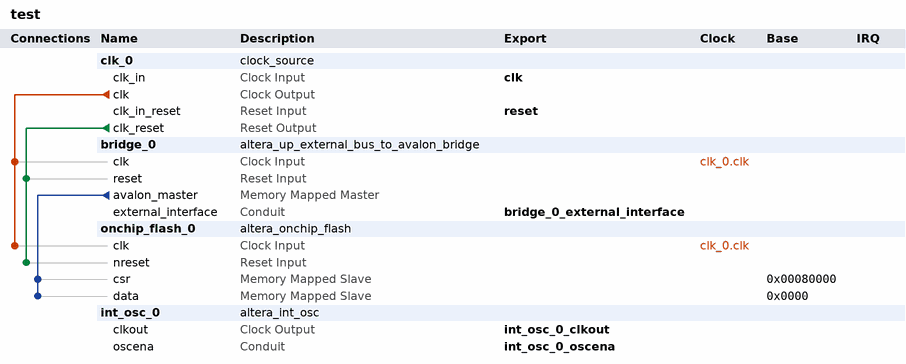
[diagram p0: system contents]
# Platform Designer (Qsys) system test, MAX 10 10M16SCU169C8G
# Parameters at their usual value, and those the tool derives, are not listed.
package require -exact qsys 22.1
create_system test
set_project_property DEVICE_FAMILY {MAX 10}
set_project_property DEVICE 10M16SCU169C8G

add_instance clk_0 clock_source 22.1
set_instance_parameter_value clk_0 clockFrequency 25000000

add_instance bridge_0 altera_up_external_bus_to_avalon_bridge 18.0
set_instance_parameter_value bridge_0 addr_size 16
set_instance_parameter_value bridge_0 addr_size_multiplier Mbytes
set_instance_parameter_value bridge_0 data_size 32

add_instance onchip_flash_0 altera_onchip_flash 22.1
set_instance_parameter_value onchip_flash_0 CLOCK_FREQUENCY 25.0
set_instance_parameter_value onchip_flash_0 CONFIGURATION_MODE {Single Uncompressed Image}
set_instance_parameter_value onchip_flash_0 SECTOR_ACCESS_MODE {Read and write,Read and write,Hidden,Read and write,Read and write}
set_instance_parameter_value onchip_flash_0 initFlashContent false
set_instance_parameter_value onchip_flash_0 initializationFileName altera_onchip_flash.hex
set_instance_parameter_value onchip_flash_0 useNonDefaultInitFile false

add_instance int_osc_0 altera_int_osc 22.1
set_instance_parameter_value int_osc_0 CBX_AUTO_BLACKBOX ALL
set_instance_parameter_value int_osc_0 CLOCK_FREQUENCY_1 116
set_instance_parameter_value int_osc_0 CLOCK_FREQUENCY_2 77
set_instance_parameter_value int_osc_0 PART_NAME 10M16SCU169C8G

# connections
add_connection clk_0.clk bridge_0.clk clock
add_connection clk_0.clk onchip_flash_0.clk clock
add_connection clk_0.clk_reset bridge_0.reset reset
add_connection clk_0.clk_reset onchip_flash_0.nreset reset
add_connection bridge_0.avalon_master onchip_flash_0.csr avalon
set_connection_parameter_value bridge_0.avalon_master/onchip_flash_0.csr baseAddress 0x00080000
add_connection bridge_0.avalon_master onchip_flash_0.data avalon
set_connection_parameter_value bridge_0.avalon_master/onchip_flash_0.data baseAddress 0x0000

# exported interfaces
add_interface bridge_0_external_interface conduit end
set_interface_property bridge_0_external_interface EXPORT_OF bridge_0.external_interface
add_interface clk clock sink
set_interface_property clk EXPORT_OF clk_0.clk_in
add_interface int_osc_0_clkout clock source
set_interface_property int_osc_0_clkout EXPORT_OF int_osc_0.clkout
add_interface int_osc_0_oscena conduit end
set_interface_property int_osc_0_oscena EXPORT_OF int_osc_0.oscena
add_interface reset reset sink
set_interface_property reset EXPORT_OF clk_0.clk_in_reset

set_interconnect_requirement {$system} qsys_mm.clockCrossingAdapter HANDSHAKE
set_interconnect_requirement {$system} qsys_mm.enableEccProtection FALSE
set_interconnect_requirement {$system} qsys_mm.insertDefaultSlave FALSE
set_interconnect_requirement {$system} qsys_mm.maxAdditionalLatency 1

save_system test.qsys
